# EAGLE schematic Main (EAGLE 7.2.0)
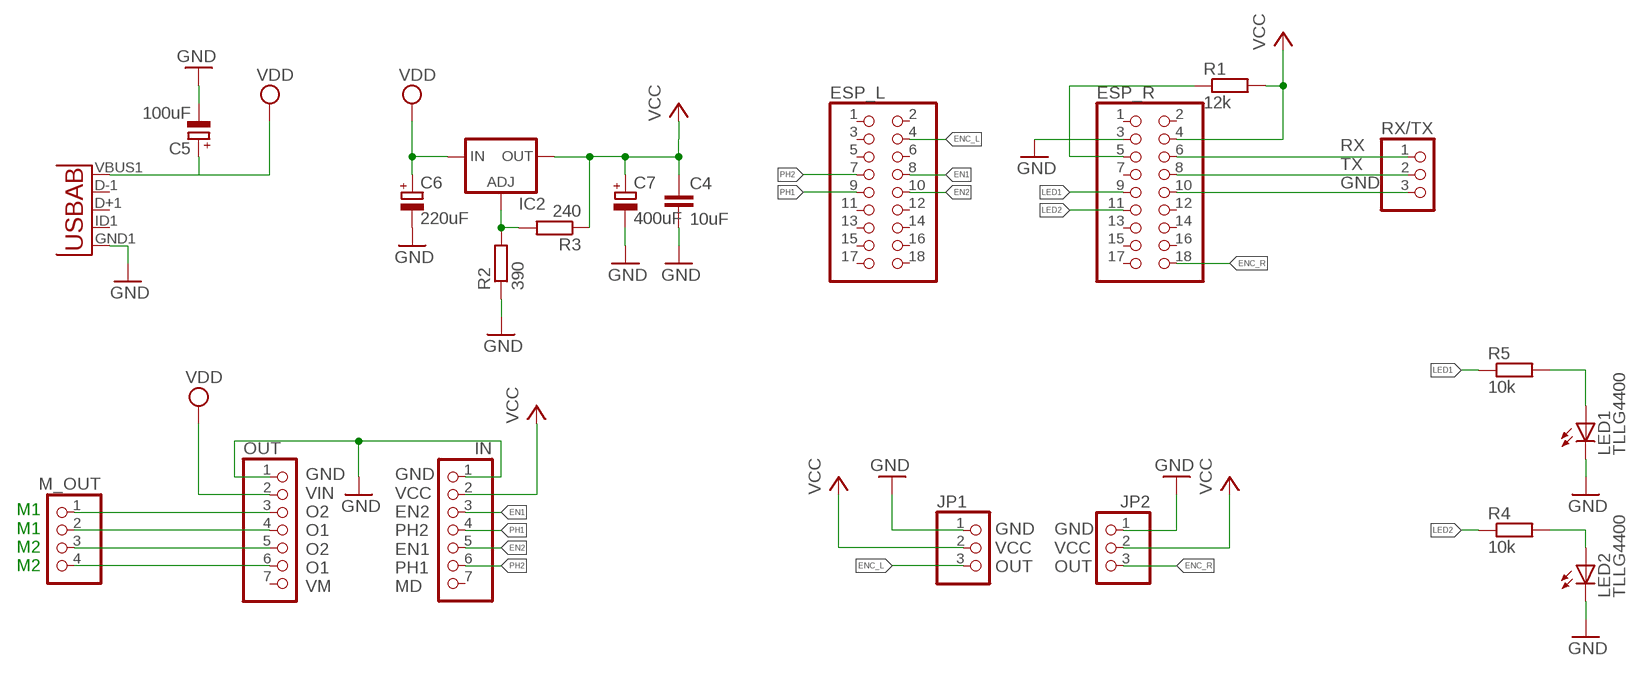
[diagram p0: schematic, sheet 1]

## Parts
C4  10uF  C-EU050-025X075  [C050-025X075]
C5  100uF  CPOL-EUE2.5-6  [E2,5-6]
C6  220uF  CPOL-EUE2.5-6  [E2,5-6]
C7  400uF  CPOL-EUE2.5-6  [E2,5-6]
ESP_L  PINHD-2X9  [2X09]
ESP_R  PINHD-2X9  [2X09]
IC2  LM317TL  [317TL]
IN  PINHD-1X7  [1X07]
JP1  PINHD-1X3  [1X03]
JP2  PINHD-1X3  [1X03]
LED1  TLLG4400  [LED3MM]
LED2  TLLG4400  [LED3MM]
M_OUT  PINHD-1X4  [1X04]
OUT  PINHD-1X7  [1X07]
R1  12k  R-EU_0207/10  [0207/10]
R2  390  R-EU_0207/10  [0207/10]
R3  240  R-EU_0207/10  [0207/10]
R4  10k  R-EU_0207/10  [0207/10]
R5  10k  R-EU_0207/10  [0207/10]
RX/TX  PINHD-1X3  [1X03]
U3  USB""  [USB-MICRO-SMD]

## Nets
EN1: ESP_L.8 IN.3
EN2: ESP_L.10 IN.5
ENC_L: ESP_L.4 JP1.3
ENC_R: ESP_R.18 JP2.3
GND: C4.2 C5.- C6.- C7.- ESP_R.3 IN.1 JP1.1 JP2.1 LED1.K(C) LED2.K(C) OUT.1 R2.1 U3.GND1(GND)
LED1: ESP_R.9 R5.1
LED2: ESP_R.11 R4.1
N$1: M_OUT.1 OUT.3
N$2: M_OUT.2 OUT.4
N$3: M_OUT.3 OUT.5
N$4: M_OUT.4 OUT.6
N$6: ESP_R.6 RX/TX.1
N$7: IC2.1(ADJ) R2.2 R3.2
N$9: ESP_R.10 RX/TX.3
N$10: LED2.A R4.2
N$12: ESP_R.5 R1.1
N$13: LED1.A R5.2
N$14: ESP_R.8 RX/TX.2
PH1: ESP_L.9 IN.4
PH2: ESP_L.7 IN.6
VCC: C4.1 C7.+ ESP_R.4 IC2.2(OUT) IN.2 JP1.2 JP2.2 R1.2 R3.1
VDD: C5.+ C6.+ IC2.3(IN) OUT.2 U3.VBUS1(VBUS)
Unconnected: ESP_L.1 ESP_L.2 ESP_L.3 ESP_L.5 ESP_L.6 ESP_L.11 ESP_L.12 ESP_L.13 ESP_L.14 ESP_L.15 ESP_L.16 ESP_L.17 ESP_L.18 ESP_R.1 ESP_R.2 ESP_R.7 ESP_R.12 ESP_R.13 ESP_R.14 ESP_R.15 ESP_R.16 ESP_R.17 IN.7 OUT.7 U3.D+1(D+) U3.D-1(D-) U3.ID1(USBID)

## Notes on the sheet
- RX
  TX
  GND
- M1
  M1
  M2
  M2
- GND
  VCC
  OUT
- GND
  VCC
  OUT
- GND
  VIN
  O2
  O1
  O2
  O1
  VM
- GND
  VCC
  EN2
  PH2
  EN1
  PH1
  MD

## Library data of the parts
C4 = resistor:C-EU: CAPACITOR, European symbol
C5-C7 = rcl:CPOL-EU: POLARIZED CAPACITOR, European symbol
ESP_L ESP_R = pinhead:PINHD-2X9: PIN HEADER
IC2 = v-reg:LM317TL: VOLTAGE REGULATOR
IN OUT = pinhead:PINHD-1X7: PIN HEADER
JP1 JP2 RX/TX = pinhead:PINHD-1X3: PIN HEADER
LED1 LED2 = led:TLLG4400: Low Current (2mA) LED 3 mm Tinted Diffused Package color GREEN Source: Data sheet <http://www.farnell.com/datasheets/391098.pdf>; MF: VISHAY SEMICONDUCTOR; OC_FARNELL: 1612435
M_OUT = pinhead:PINHD-1X4: PIN HEADER
R1-R5 = rcl:R-EU_: RESISTOR, European symbol
U3 = MicroUSB:USB: This is a USB AB connector that is compatible with USB OTG. i.e. this connector can serve as a host or device